# EAGLE design PowerSupply (EAGLE 9.3.0)
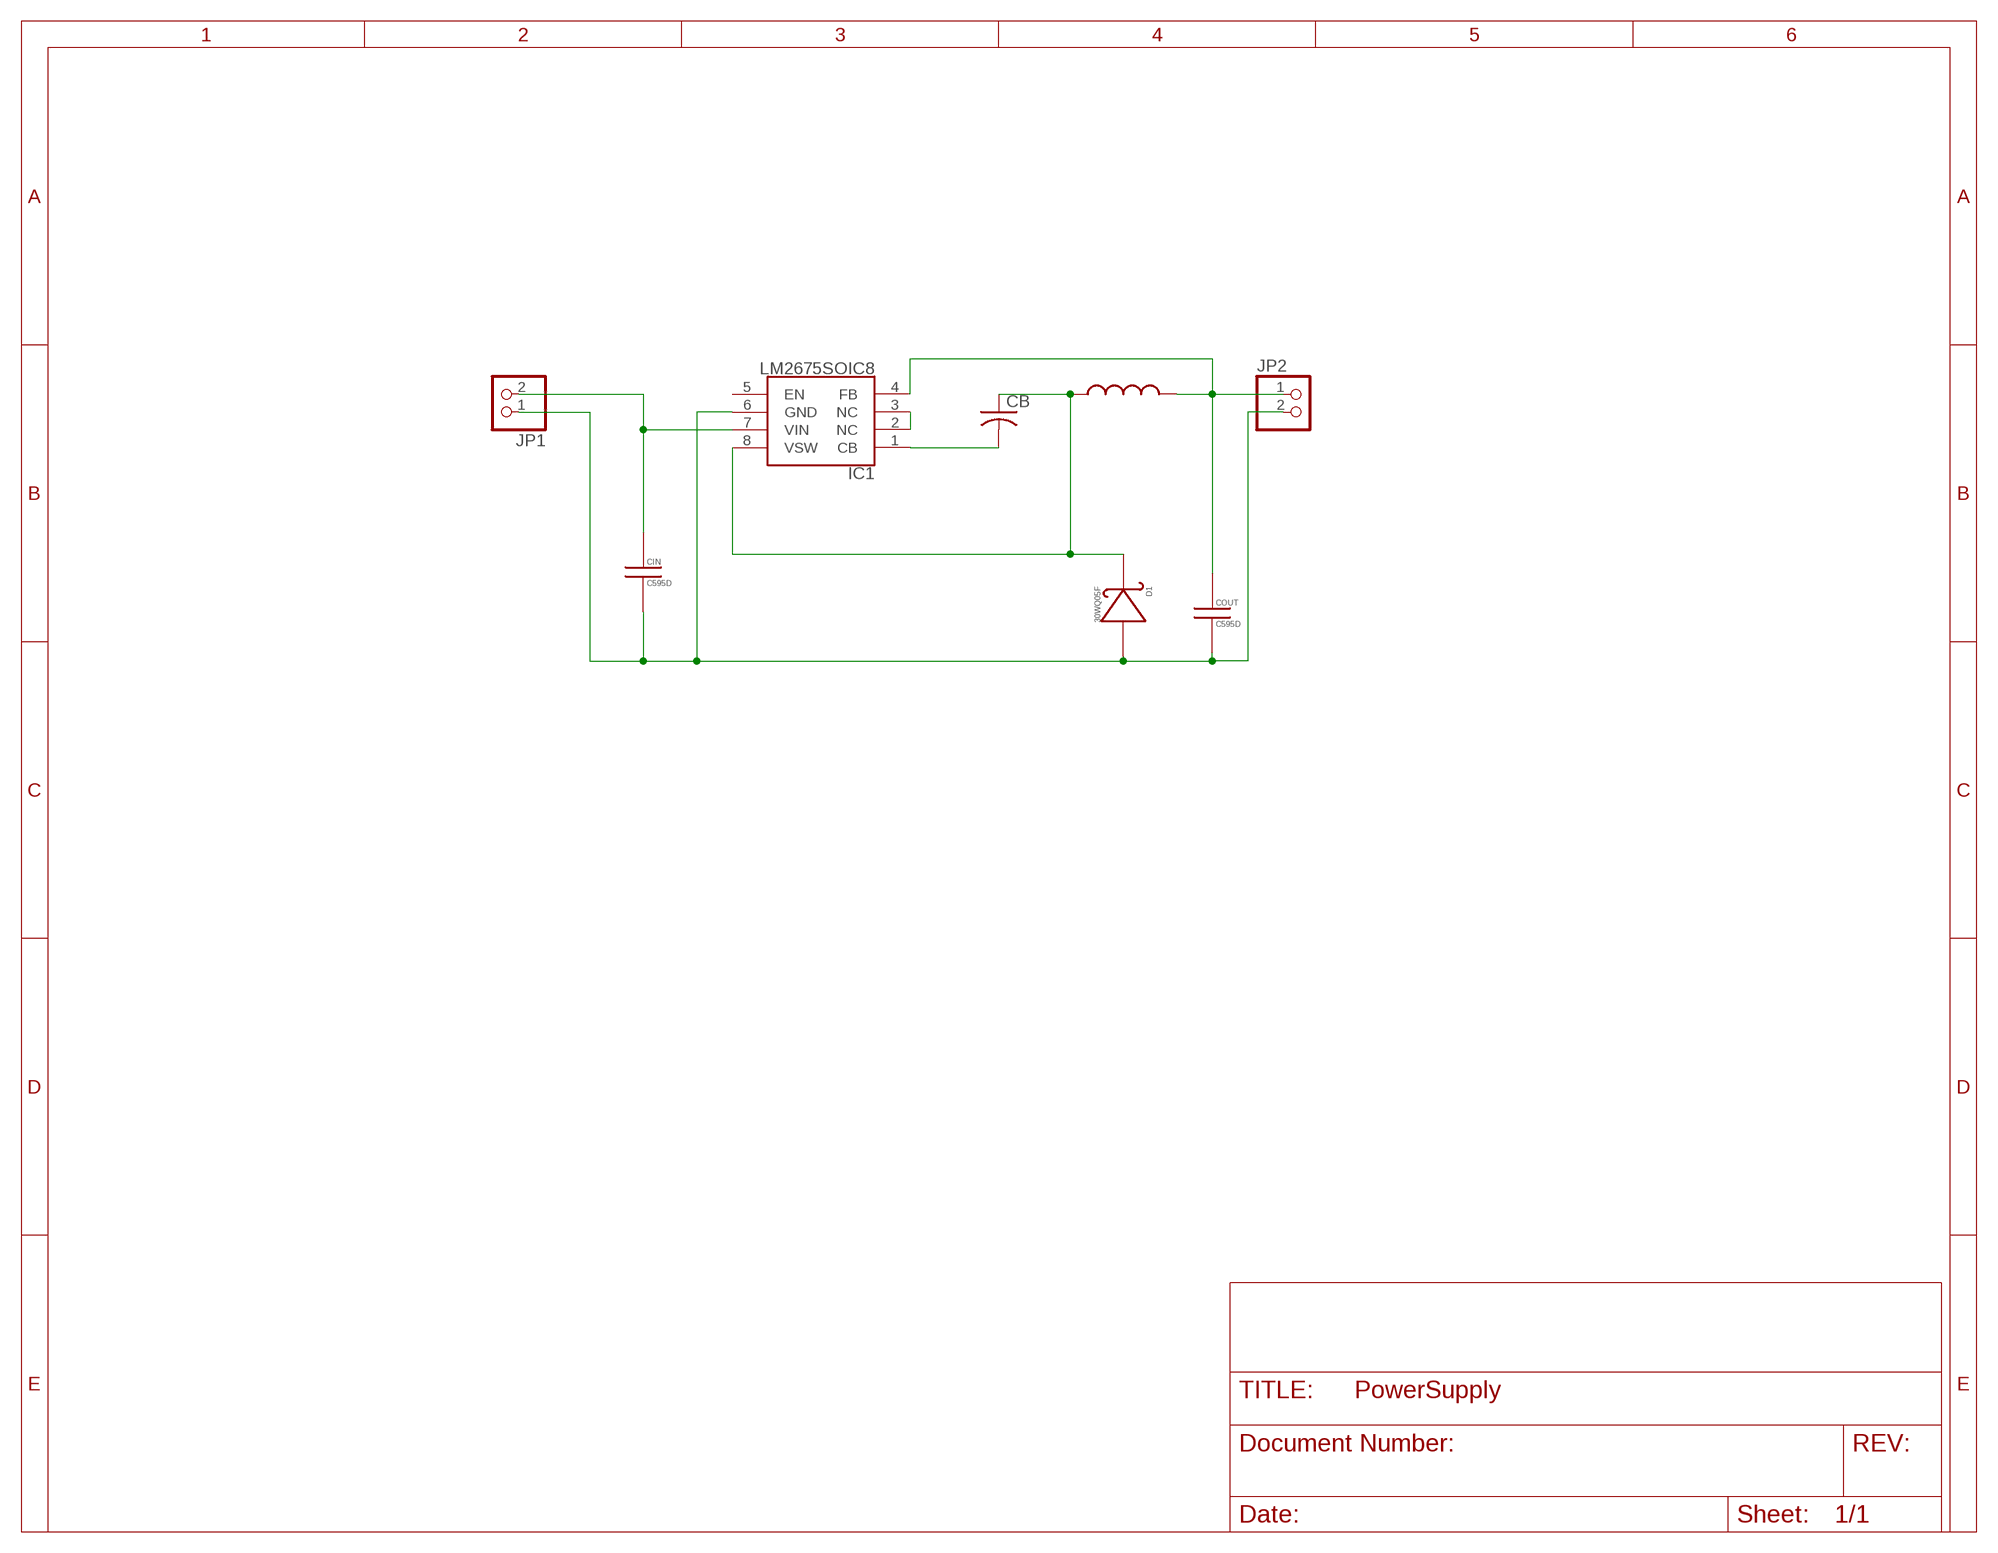
[diagram p0: schematic, sheet 1]

## Parts
CB  0.01uF  C-USC1206  [C1206]
CIN  C595D  [C_595D]
COUT  C595D  [C_595D]
D1  30WQ05F  [D_SMA]
IC1  LM2675SOIC8  [SO8]
JP1  PINHD-1X2  [1X02]
JP2  PINHD-1X2  [1X02]
L  SDR1005L_SMD_V  [L_SMD]

## Nets
N$1: CIN.P$2 IC1.7(VIN) JP1.2
N$2: CIN.P$1 COUT.P$1 D1.P$1 IC1.6(GND) JP1.1 JP2.2
N$3: COUT.P$2 IC1.4(FB) JP2.1 L.P$1
N$5: CB.1 D1.P$2 IC1.8(VSW) L.P$2
N$6: CB.2 IC1.1(CB)
N$7: IC1.2(NC) IC1.3(NC)
Unconnected: IC1.5(EN)

## Library data of the parts
CB = rcl:C-US: CAPACITOR, American symbol; SPICEPREFIX: C
CIN COUT = ECE477_Resources:C
D1 = ECE477_Resources:30WQ05F
IC1 = ECE477_Tutorial:LM2675
JP1 JP2 = pinhead:PINHD-1X2: PIN HEADER
L = ECE477_Tutorial:SDR1005

## Board
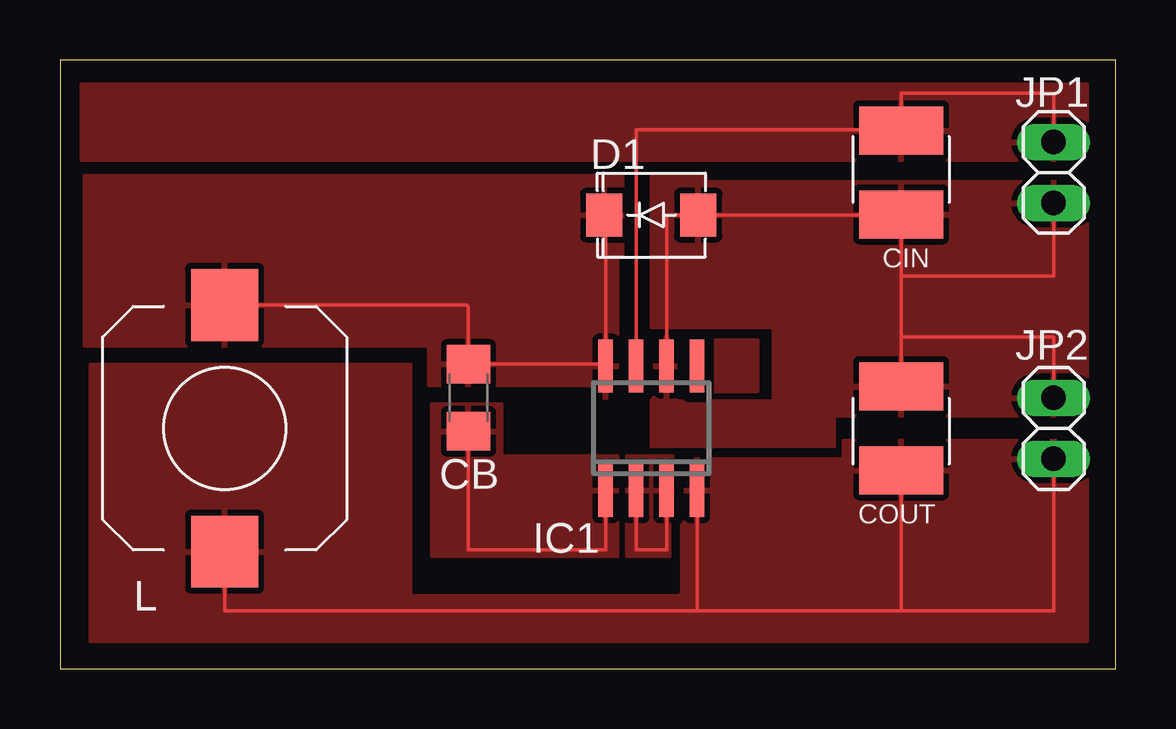
[diagram p1: board, top side]

Size 43.99 x 25.39 mm. Coordinates in mm from the lower left corner, seen from the top.
Outline: 0,0 43.99,0 43.99,25.39 0,25.39 0,0
Copper layers (1*16): Top 0.0356mm / dielectric 1.5011mm / Bottom 0.0356mm
Design rules "ECE_Senior_Design": minimum track width 8mil, minimum drill 13mil, track to track 8mil, track to pad 8mil, pad to pad 6mil, via to via 8mil, smd to smd 6mil, copper to edge 15mil, drill to drill 8mil, minimum pad ring 7mil, minimum via ring 7mil, stop-mask expansion 3mil, vias tented up to drill 0mil, thermal gap 10mil

### Footprints (pad centres in the part's own frame; a part is rotated, then mirrored left to right if it is on the bottom)
C1206 = smd 1.6 x 1.8: 1 -1.4,0; 2 1.4,0
C_595D = smd 3.5 x 2: P$1 0,-1.75; P$2 0,1.75
D_SMA = smd 1.51 x 1.78: P$1 1.96,0; P$2 -1.96,0
SO8 = smd 0.6 x 2.2: 1 -1.905,-2.6; 2 -0.635,-2.6; 3 0.635,-2.6; 4 1.905,-2.6; 5 1.905,2.6; 6 0.635,2.6; 7 -0.635,2.6; 8 -1.905,2.6
1X02 = drill 1.016 long: 1 -1.27,0; 2 1.27,0
L_SMD = smd 2.997 x 2.794: P$1 -5.144,0; P$2 5.144,0

### Placement (x,y rotation side)
CB  17.02,11.3 270 top
CIN  35.05,20.7 0 top
COUT  35.05,10.03 180 top
D1  24.64,18.92 0 top
IC1  24.64,10.03 0 top
JP1  41.4,20.7 90 top
JP2  41.4,10.03 90 top
L  6.86,10.03 90 top

### Tracks (layer width: path | path; a pad name or v marks a point on that pad's centre or on a via)
N$1
  Top 0.152: IC1.7 24,22.48 35.02,22.48 CIN.P$2 35.05,24 41.4,24 JP1.2
  pour Top (isolate 0.406): 0.89,24.38 42.8,24.38 42.8,21.21 1.02,21.21 0.89,21.21
N$2
  Top 0.152: IC1.6 25.27,18.92 D1.P$1 35.02,18.92 CIN.P$1 35.05,16.38 | 35.05,16.38 35.05,13.84 | 35.05,13.84 COUT.P$1 | JP2.2 41.4,13.84 35.05,13.84 | JP1.1 41.4,16.38 35.05,16.38
  pour Top (isolate 0.406): 24.64,20.57 24.64,14.22 29.72,14.22 29.72,11.18 25.65,11.18 25.65,13.84 24.64,13.84 24.64,9.27 30.1,9.27 32.26,9.27 32.26,10.54 42.8,10.54 42.8,20.32 26.92,20.32 26.92,20.57
N$3
  Top 0.152: L.P$1 6.86,2.41 26.54,2.41 | 26.54,2.41 IC1.4 | 26.54,2.41 35.05,2.41 | 35.05,2.41 41.4,2.41 JP2.1 | 35.05,2.41 COUT.P$2
  pour Top (isolate 0.406): 25.91,8.76 32.64,8.76 32.64,9.52 42.8,9.52 42.8,1.14 1.27,1.14 1.27,12.7 14.61,12.7 14.61,3.05 25.78,3.05 25.91,3.17
N$5
  Top 0.152: L.P$2 16.95,15.18 17.02,15.11 CB.1 22.66,12.7 IC1.8 22.73,18.87 D1.P$2
  pour Top (isolate 0.406): 1.02,20.57 1.02,13.46 15.37,13.46 15.37,11.81 22.22,11.81 22.22,11.3 23.24,11.3 23.24,17.27 23.5,17.27 23.5,20.57
N$6
  Top 0.152: CB.2 17.02,4.95 22.73,4.95 IC1.1
  pour Top (isolate 0.406): 15.49,11.05 18.16,11.05 18.41,11.05 18.41,8.89 23.24,8.89 23.24,4.7 15.75,4.7 15.49,4.7 15.49,10.92
N$7
  Top 0.152: IC1.2 24,4.95 25.27,4.95 IC1.3
  pour Top (isolate 0.406): 23.62,8.89 23.62,4.7 25.4,4.7 25.4,6.35 25.53,6.35 25.53,8.89
TEMP
  pour Top (isolate 0.406): 26.29,13.21 26.8,13.21 26.8,11.81 26.29,11.81 26.29,11.56 29.08,11.56 29.08,13.72 26.29,13.72